# Altium schematic sheet Fri3D_2020_Peripherals.SchDoc: Peripherals
size A3; Date: 01/01/2022; DrawnBy: Wim Van Gool; DocumentNumber: 3; Revision: 02; SheetNumber: 3; SheetTotal: 4
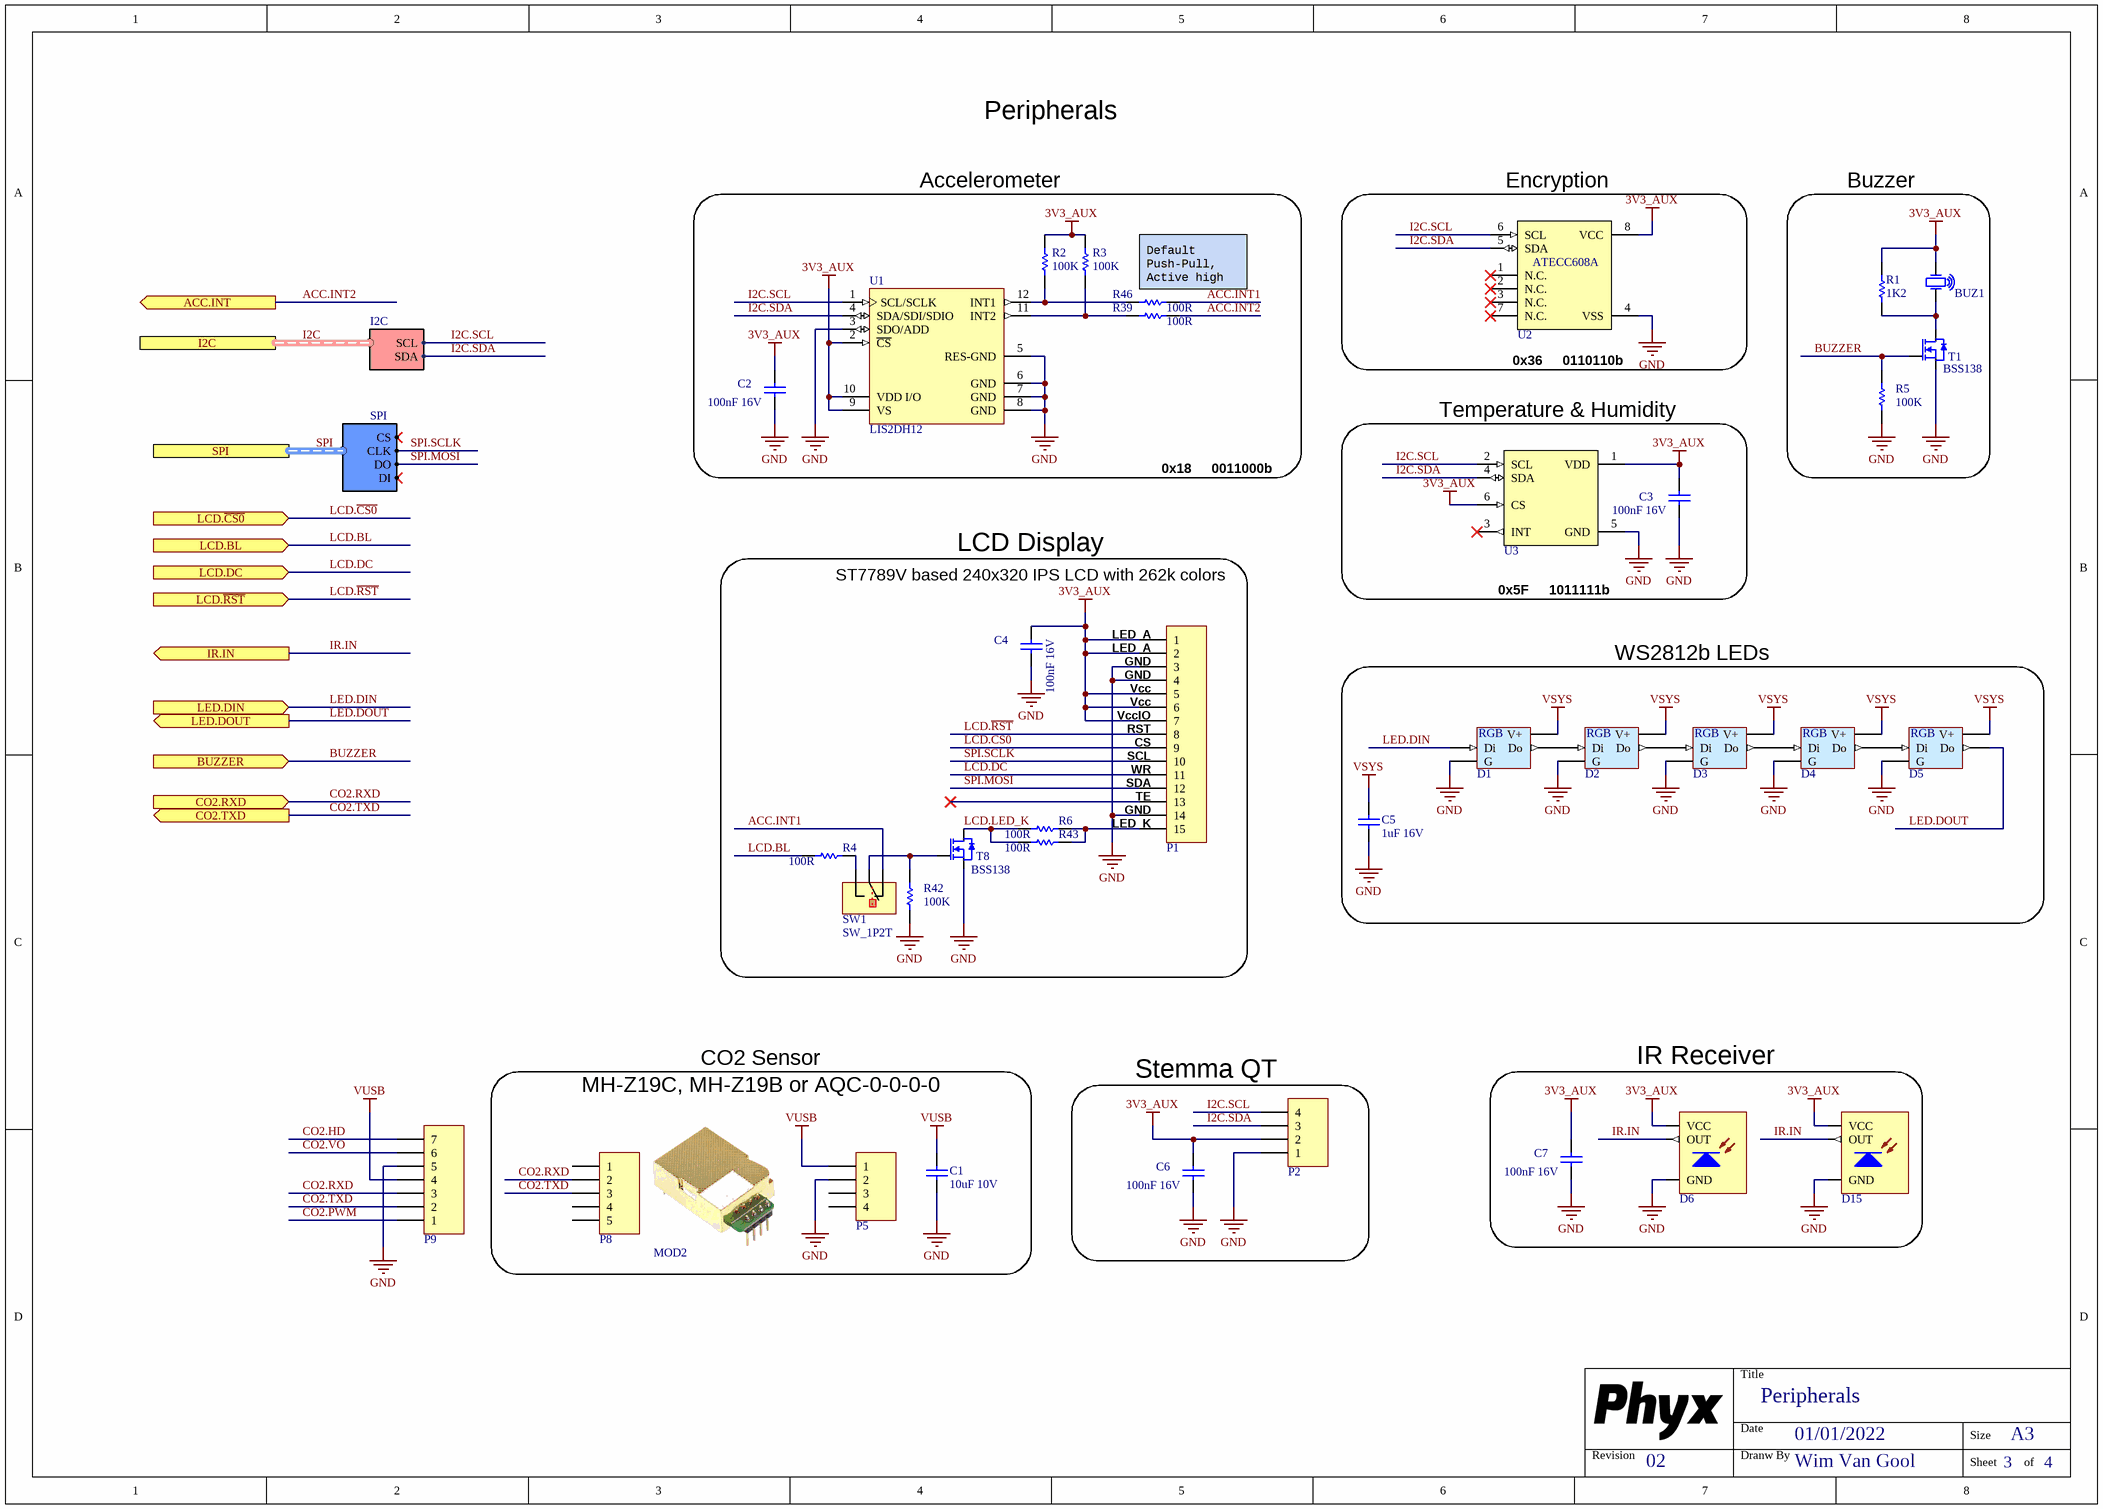
[diagram p0: Fri3D_2020_Peripherals.SchDoc]

## Parts
BUZ1  12x12x3mm Piezo Buzzer Transducer 81dB  [CUI_CMT-1203-SMT]  (value not drawn)
C1  value 10uF 10V  [C0805_N]  (hidden comment: CAP_CERAMIC)
C2  value 100nF 16V  [C0603_N]
C3  value 100nF 16V  [C0603_N]
C4  value 100nF 16V  [C0603_N]
C5  value 1uF 16V  [C0603_N]  (hidden comment: CAP_CERAMIC)
C6  value 100nF 16V  [C0603_N]
C7  value 100nF 16V  [C0603_N]
D1  WS2812 based digital RGB LED 5050 Black package  [LED_5050_WS2812B_BLACK]  (value not drawn)
D2  WS2812 based digital RGB LED 5050 Black package  [LED_5050_WS2812B_BLACK]  (value not drawn)
D3  WS2812 based digital RGB LED 5050 Black package  [LED_5050_WS2812B_BLACK]  (value not drawn)
D4  WS2812 based digital RGB LED 5050 Black package  [LED_5050_WS2812B_BLACK]  (value not drawn)
D5  WS2812 based digital RGB LED 5050 Black package  [LED_5050_WS2812B_BLACK]  (value not drawn)
D6  IRM-3638N3F14 Infrared Receiver 38 kHz 45° 2.7-5.5V  [VIS_TSOP381x_BENT]  (value not drawn)
D15  ZIRM-5042B-42-Z2 Infrared Receiver 38 kHz 45° 2.7-5.5V 940nm  [CHAU_ZIRM-5042B-42-Z2]  (value not drawn)
MOD2  MH-Z19C CO2 Sensor TH Pins  [WIN_MH-Z19x-PH]  (value not drawn)
P1  Bottom contact FPC 0.3mm pitch 15 contacts  [FPC_AFE03-S15FMA-1H]  (value not drawn)
P2  Header 1.0mm RA Shrouded 4  [WE_665104131822]  (value not drawn)
P5  Receptacle 4 SMD Type 2  [WE_61000413321]  (value not drawn)
P8  Receptacle 5 SMD Type 2  [WE_61000513321]  (value not drawn)
P9  Molex Picoblade SMD RA 532610771  [MLX_53261-0771]  (value not drawn)
R1  value 1K2  [R0603_N]  (hidden comment: RESISTOR)
R2  value 100K  [R0603_N]  (hidden comment: RESISTOR)
R3  value 100K  [R0603_N]  (hidden comment: RESISTOR)
R4  value 100R  [R0603_N]  (hidden comment: RESISTOR)
R5  value 100K  [R0603_N]  (hidden comment: RESISTOR)
R6  value 100R  [R0603_N]  (hidden comment: RESISTOR)
R39  value 100R  [R0603_N]  (hidden comment: RESISTOR)
R42  value 100K  [R0603_N]  (hidden comment: RESISTOR)
R43  value 100R  [R0603_N]  (hidden comment: RESISTOR)
R46  value 100R  [R0603_N]  (hidden comment: RESISTOR)
SW1  SW_1P2T  [WE_450404015514]
T1  value BSS138  [SOT23-3]  (hidden comment: 0.2A N-Ch MOSFET Vgs 3.2)
T8  value BSS138  [SOT23-3]  (hidden comment: 0.2A N-Ch MOSFET Vgs 3.2)
U1  LIS2DH12  [STM_LGA12_2x2]
U2  Encryption Authentication with 72b SN, SHA-256, AES-128  [SOIC_N_8]  (value not drawn)
U3  WSEN-HIDS 2525020210001 temperature and humidity sensor Digital I2C  [WE_2525020210001]  (value not drawn)

## Blocks framed on the sheet
Accelerometer: C2 R2 R3 R39 R46 U1
Encryption: U2
Buzzer: BUZ1 R1 R5 T1
Temperature & Humidity: C3 U3
LCD Display: C4 P1 R4 R6 R42 R43 SW1 T8
WS2812b LEDs: C5 D1-D5
Stemma QT: C6 P2
IR Receiver: C7 D6 D15

## Ports
ACC.INT (out), BUZZER (in), CO2.RXD (in), CO2.TXD (out), I2C (harness I2C), IR.IN (out), LCD.BL (in), LCD.DC (in), LCD.~{CS0} (in), LCD.~{RST} (in), LED.DIN (in), LED.DOUT (out), SPI (harness SPI)

## Harnesses
I2C: SDA, SCL
SPI: CS, CLK, DO, DI

## Nets
3V3_AUX: BUZ1.1(OSC1) C2.1 C3.1 C4.1 C6.1 C7.1 D6.3(VCC) D15.3(VCC) P1.1 P1.2 P1.5 P1.6 P1.7 P2.2 R1.1 R2.1 R3.1 U1.2(~{CS}) U1.9(VS) U1.10(VDD_I/O) U2.8(VCC) U3.1(VDD) U3.6(CS)
GND: C1.2 C2.2 C3.2 C4.2 C5.2 C6.2 C7.2 D1.3(G) D2.3(G) D3.3(G) D4.3(G) D5.3(G) D6.2(GND) D15.2(GND) P1.3 P1.4 P1.14 P2.1 P5.2 P9.5 R5.2 R42.2 T1.2(S) T8.2(S) U1.3(SDO/ADD) U1.5(RES-GND) U1.6(GND) U1.7(GND) U1.8(GND) U2.4(VSS) U3.5(GND)
VSYS: C5.1 D1.1(V+) D2.1(V+) D3.1(V+) D4.1(V+) D5.1(V+)
VUSB: C1.1 P5.1 P9.4
ACC.INT1: R46.2 SW1.1
ACC.INT2: R39.2 ; port ACC.INT
BUZZER: R5.1 T1.1(G) ; port BUZZER
CO2.HD: P9.7
CO2.PWM: P9.1
CO2.RXD: P8.2 P9.3 ; port CO2.RXD
CO2.TXD: P8.3 P9.2 ; port CO2.TXD
CO2.VO: P9.6
I2C.SCL: P2.4 U1.1(SCL/SCLK) U2.6(SCL) U3.2(SCL) ; port I2C.SCL
I2C.SDA: P2.3 U1.4(SDA/SDI/SDIO) U2.5(SDA) U3.4(SDA) ; port I2C.SDA
IR.IN: D6.1(OUT) D15.1(OUT) ; port IR.IN
LCD.BL: R4.2 ; port LCD.BL
LCD.~{CS0}: P1.9 ; port LCD.~{CS0}
LCD.DC: P1.11 ; port LCD.DC
LCD.LED_K: R6.2 R43.2 T8.3(D)
LCD.~{RST}: P1.8 ; port LCD.~{RST}
LED.DIN: D1.4(Di) ; port LED.DIN
LED.DOUT: D5.2(Do) ; port LED.DOUT
SPI.MOSI: P1.12 ; port SPI.DO  [project net SPI.DO]
SPI.SCLK: P1.10 ; port SPI.CLK  [project net SPI.CLK]
NetBUZ1_2: BUZ1.2(OSC2) R1.2 T1.3(D)
NetD1_2: D1.2(Do) D2.4(Di)
NetD2_2: D2.2(Do) D3.4(Di)
NetD3_2: D3.2(Do) D4.4(Di)
NetD4_2: D4.2(Do) D5.4(Di)
NetP1_15: P1.15 R6.1 R43.1
NetR2_2: R2.2 R46.1 U1.12(INT1)
NetR3_2: R3.2 R39.1 U1.11(INT2)
NetR4_1: R4.1 SW1.3
NetR42_1: R42.1 SW1.2 T8.1(G)

Not connected (* = marked no-connect by the designer): P1 13*; P5 3 4; P8 1 4 5; U2 1(N.C.)* 2(N.C.)* 3(N.C.)* 7(N.C.)*; U3 3(INT)*

## Buses and harness runs
harness I2C = port I2C
harness SPI = port SPI

## Notes on the sheet
- (near R46) Default Push-Pull, Active high
- (near U2) 0x36
- (near U2) 0110110b
- 0x18
- 0011000b
- ST7789V based 240x320 IPS LCD with 262k colors
- (near P1) LED_A
- (near P1) GND
- (near U3) 0x5F
- (near U3) 1011111b
- (near P1) Vcc
- (near P1) VccIO
- (near P1) RST
- (near P1) CS
- (near P1) SCL
- (near P1) WR
- (near P1) SDA
- (near P1) TE
- (near P1) LED_K
- CO2 Sensor
- MH-Z19C, MH-Z19B or AQC-0-0-0-0
- Title
- Revision
- Date
- Dranw By
- Size
- A3
- Sheet
- of
- (in symbol CRYPTO # ATECC608A I2C SOIC-8) ATECC608A
- (in symbol LED # RGB WS2812B-5050 BL) RGB

## Library data of the parts
BUZ1 = BUZ # CUI CMT-1203-SMT: Crystal Oscillator; Value: CMT-1203-SMT; Supplier 1: Digikey; Supplier Part Number 1: 102-2197-1-ND; Supplier 2: Aliexpress; Supplier Part Number 2: KLJ-1230
C1 = CAP # 10uF 10V 0805: Capacitor Ceramic; Supplier 1: Farnell; Supplier Part Number 1: 2320859
C2-C4 C6 C7 = CAP # 100nF 16V 0603: Capacitor Ceramic
C5 = CAP # 1uF 16V 0603: Capacitor Ceramic; Supplier 1: Farnell; Supplier Part Number 1: 2320814
D1-D5 = LED # RGB WS2812B-5050 BL: =Description; Value: WS218B 5050 BL; Supplier 1: Aliexpress; Supplier Part Number 1: WS2812B Black 5050
D6 = PHO IR Rx RA: =Description; Value: IRM-3638N3F14; Supplier 1: LCSC; Supplier Part Number 1: C264262
D15 = PHO # IR Rx 940nm ZIRM-5042B-42-Z2: =Description; Value: ZIRM-5042B-42-Z2; Supplier 1: LCSC; Supplier Part Number 1: C575386
MOD2 = CO2 MH-Z19C-PH: Winsen MH-Z19x-PH series of CO2 sensors; Description: CO2 MH-Z19C-PH; Supplier 1: Reichelt; Supplier Part Number 1: CO2 MH-Z19C-PH
P1 = FPC # 15 Bottom 0.3mm AFE03-S15FMA-1H: Value: AFE03-S15FMA-1H; Supplier 1: LCSC; Supplier Part Number 1: C262541
P2 = HDR # RA SHR 1.0mm 4way - 665104131822: Value: 665104131822; Supplier 1: Wurth; Supplier Part Number 1: 665104131822; Supplier 2: Mouser; Supplier Part Number 2: 710-665104131822
P5 = Receptacle # 2.54mm 4way Type 2: Value: 61000413321; Description: Receptacle # 2.54mm 4way Type 2; Supplier 1: Wurth; Supplier Part Number 1: 61000413321
P8 = Receptacle # 2.54mm 5way Type 2: Value: 61000513321; Description: Receptacle # 2.54mm 5way Type 2; Supplier 1: Wurth; Supplier Part Number 1: 61000513321
P9 = HDR # RA SHR 1.25mm 7way Molex Picoblade: Description: HDR # RA SHR 1.25mm 7way Molex Picoblade; Value: 532610771; Supplier 1: LCSC; Supplier Part Number 1: C505276; Supplier 2: Farnell; Supplier Part Number 2: 1125361; Supplier 3: Digi-Key; Supplier Part Number 3: WM7625CT-ND
R1 = RES # 1K2 0603
R2 R3 R5 R42 = RES # 100K 0603: Supplier 3: Generic; Supplier Part Number 3: 100K 1% 0603
R4 R6 R39 R43 R46 = RES # 100R 0603
SW1 = SW # 1P2T WS-SLSU mini slide 6,7 x 2,7 mm
T1 T8 = BSS138 N-Ch MOSFET 0.2A 3.2Vgs 60Vds: Supplier 1: Farnell; Supplier Part Number 1: 2432717
U1 = ACCELERO # LIS2DH12: =Description
U2 = CRYPTO # ATECC608A I2C SOIC-8: =Description; Value: ATECC608A-SSHDA-T; Supplier 1: Farnell; Supplier Part Number 1: 2920872; Supplier 2: Digi-key; Supplier Part Number 2: ATECC608A-SSHDA-TCT-ND; Supplier 3: Mouser; Supplier Part Number 3: 556-ATECC608ASSHDAT
U3 = TMP HUM # WSEN-HIDS: =Description; Value: 2525020210001; Supplier 1: Digi-key; Supplier Part Number 1: 1917-2525020210001CT-ND; Supplier 2: Farnell; Supplier Part Number 2: 3759082; Supplier 3: Mouser; Supplier Part Number 3: 710-2525020210001